# Altium project simulateTest.PrjPCB
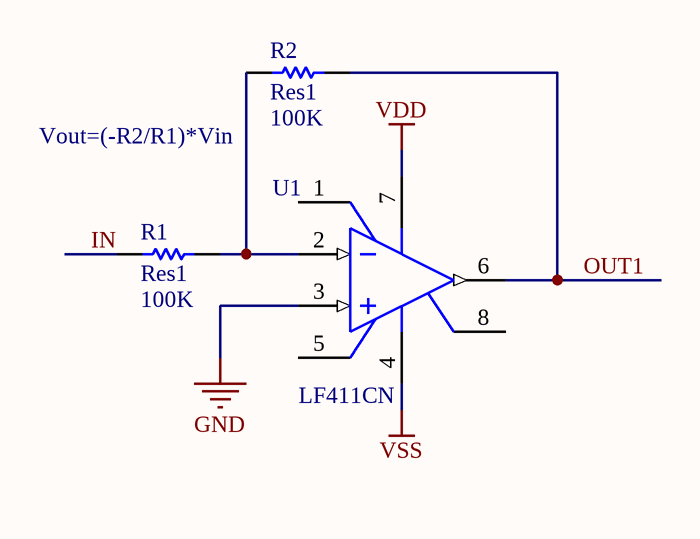
[diagram p0: InverterAmp.SchDoc]
11 sheets, 61 parts. Net scope: global (net labels, ports and power ports of the same name join across sheets).
Sheets:
  InverterAmp.SchDoc
  amplifier.SchDoc
  powerSource.SchDoc
  summator.SchDoc
  InverterSum.SchDoc
  subtracter.SchDoc
  integrator.SchDoc
  differentiator.SchDoc
  differentialAmp.SchDoc
  currentDetection.SchDoc
  sine-waveGenerator.SchDoc

## Sheet InverterAmp.SchDoc
size A4

### Parts
R1  Res1  value 100K  [AXIAL-0.3]
R2  Res1  value 100K  [AXIAL-0.3]
U1  LF411CN  [N08E]

### Nets
GND: U1.3(IN+)
VDD: U1.7(V+)  [project net VDD12]
VSS: U1.4(V-)  [project net VSS12]
IN: R1.2
OUT1: R2.1 U1.6(OUT)
NetR1_1: R1.1 R2.2 U1.2(IN-)

Not connected (* = marked no-connect by the designer): U1 1(BAL) 5(BAL) 8(NC)

### Notes on the sheet
- (near R2) Vout=(-R2/R1)*Vin

### Library data of the parts
R1 R2 = Res1: Resistor; Published: 8-Jun-2000; LatestRevisionDate: 17-Jul-2002; LatestRevisionNote: Re-released for DXP Platform.; PackageReference: AXIAL-0.3; Publisher: Altium Limited; PackageDescription: Axial Device, Thru-Hole; 2 Leads; 0.3 in Pin Spacing
U1 = LF411CN: Low Offset, Low Drift JFET Input Operational Amplifier, 8-pin MDIP; Manufacturer: National Semiconductor; PackageTopMarking: NSUZXYTTE#*LF*411CN; PowerWise: N; CompType: Amplifiers; Published: 4-Dec-2008; LatestRevisionDate: 13-Jan-2009; LatestRevisionNote: Sim Model Added.; DatasheetVersion: Aug-2000; PackageVersion: revG, May-2006; PackageReference: N08E; Publisher: Altium Limited; PackageDescription: MDIP, .365 x .250 x .130in, 8 Lead, .100in Pitch; Supplier 1: Farnell; Supplier Part Number 1: 9487026; PartNumber: LF411CN; RoHS: N; PinCount: 8; Code_JEDEC: MS-001-BA; ComponentLink1Description: LF411 Datasheet; ComponentLink1URL: http://www.national.com/ds/LF/LF411.pdf; ComponentLink2Description: LF411 Web Page; ComponentLink2URL: http://www.national.com/pf/LF/LF411.html; ComponentLink3Description: N08E Package Page; ComponentLink3URL: http://www.national.com/packaging/folders/n08e.html

## Sheet amplifier.SchDoc
size A4
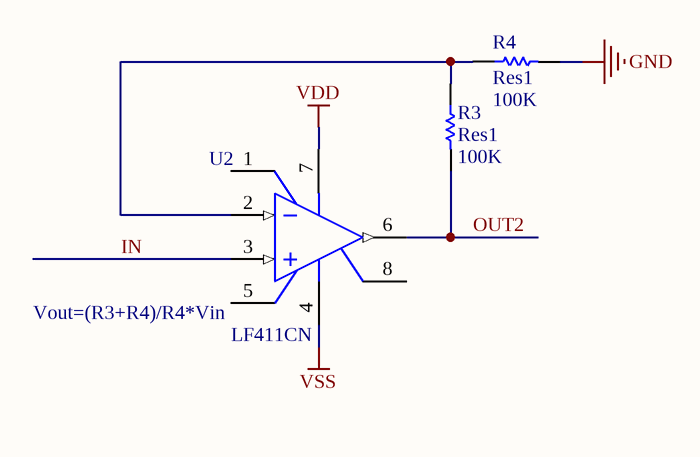
[diagram p1: amplifier.SchDoc]

### Parts
R3  Res1  value 100K  [AXIAL-0.3]
R4  Res1  value 100K  [AXIAL-0.3]
U2  LF411CN  [N08E]

### Nets
GND: R4.2
VDD: U2.7(V+)  [project net VDD12]
VSS: U2.4(V-)  [project net VSS12]
IN: U2.3(IN+)
OUT2: R3.2 U2.6(OUT)
NetR3_1: R3.1 R4.1 U2.2(IN-)

Not connected (* = marked no-connect by the designer): U2 1(BAL) 5(BAL) 8(NC)

### Notes on the sheet
- (near U2) Vout=(R3+R4)/R4*Vin

### Library data of the parts
R3 R4 = Res1: Resistor; Published: 8-Jun-2000; LatestRevisionDate: 17-Jul-2002; LatestRevisionNote: Re-released for DXP Platform.; PackageReference: AXIAL-0.3; Publisher: Altium Limited; PackageDescription: Axial Device, Thru-Hole; 2 Leads; 0.3 in Pin Spacing
U2 = LF411CN: as U1 on sheet InverterAmp; Published: 4-Dec-2008; LatestRevisionDate: 13-Jan-2009; LatestRevisionNote: Sim Model Added.; DatasheetVersion: Aug-2000; PackageVersion: revG, May-2006; PackageReference: N08E; Publisher: Altium Limited; PackageDescription: MDIP, .365 x .250 x .130in, 8 Lead, .100in Pitch; Supplier 1: Farnell; Supplier Part Number 1: 9487026; PartNumber: LF411CN; RoHS: N; PinCount: 8; Code_JEDEC: MS-001-BA; ComponentLink1Description: LF411 Datasheet; ComponentLink1URL: http://www.national.com/ds/LF/LF411.pdf; ComponentLink2Description: LF411 Web Page; ComponentLink2URL: http://www.national.com/pf/LF/LF411.html; ComponentLink3Description: N08E Package Page; ComponentLink3URL: http://www.national.com/packaging/folders/n08e.html

## Sheet powerSource.SchDoc
size A4
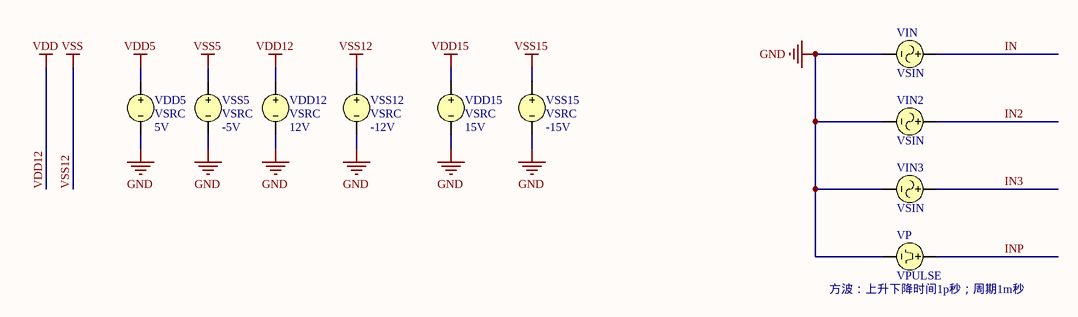
[diagram p2: powerSource.SchDoc]

### Parts
VDD5  VSRC  value 5V
VDD12  VSRC  value 12V
VDD15  VSRC  value 15V
VIN  VSIN
VIN2  VSIN
VIN3  VSIN
VP  VPULSE
VSS5  VSRC  value -5V
VSS12  VSRC  value -12V
VSS15  VSRC  value -15V

### Nets
GND: VDD5.2 VDD12.2 VDD15.2 VIN.2 VIN2.2 VIN3.2 VP.2 VSS5.2 VSS12.2 VSS15.2
VDD5: VDD5.1
VDD12: VDD12.1  [also labelled VDD]
VDD15: VDD15.1
VSS5: VSS5.1
VSS12: VSS12.1  [also labelled VSS]
VSS15: VSS15.1
IN: VIN.1
IN2: VIN2.1
IN3: VIN3.1
INP: VP.1

### Notes on the sheet
- (near VP) 方波：上升下降时间1p秒；周期1m秒

### Library data of the parts
VDD5 VDD12 VDD15 VSS5 VSS12 VSS15 = VSRC: Voltage Source; Note: PCB Footprint - Not required; Published: 8-Jun-2000; LatestRevisionDate: 17-Jul-2002; LatestRevisionNote: Re-released for DXP Platform.; PackageReference: Not Applicable; Publisher: Altium Limited
VIN VIN2 VIN3 = VSIN: Sinusoidal Voltage Source; Note: PCB Footprint - Not required; Published: 8-Jun-2000; LatestRevisionDate: 15-Nov-2004; LatestRevisionNote: Corrected Netlist.; PackageReference: Not Applicable; Publisher: Altium Limited
VP = VPULSE: Pulse Voltage Source; Note: PCB Footprint - Not required; Published: 8-Jun-2000; LatestRevisionDate: 15-Nov-2004; LatestRevisionNote: Corrected Netlist.; PackageReference: Not Applicable; Publisher: Altium Limited

## Sheet summator.SchDoc
size A4
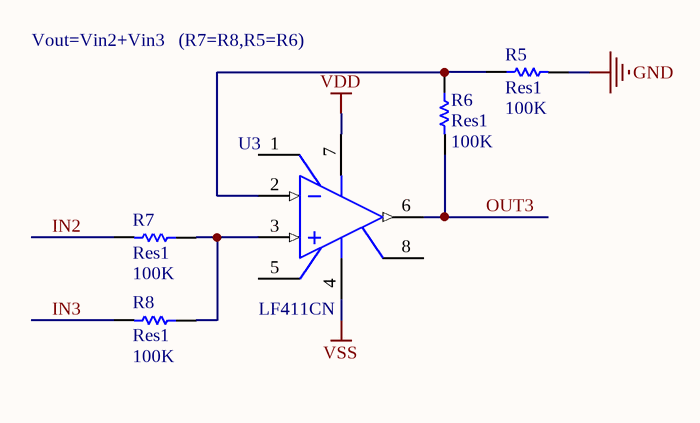
[diagram p3: summator.SchDoc]

### Parts
R5  Res1  value 100K  [AXIAL-0.3]
R6  Res1  value 100K  [AXIAL-0.3]
R7  Res1  value 100K  [AXIAL-0.3]
R8  Res1  value 100K  [AXIAL-0.3]
U3  LF411CN  [N08E]

### Nets
GND: R5.2
VDD: U3.7(V+)  [project net VDD12]
VSS: U3.4(V-)  [project net VSS12]
IN2: R7.2
IN3: R8.2
OUT3: R6.2 U3.6(OUT)
NetR5_1: R5.1 R6.1 U3.2(IN-)
NetR7_1: R7.1 R8.1 U3.3(IN+)

Not connected (* = marked no-connect by the designer): U3 1(BAL) 5(BAL) 8(NC)

### Notes on the sheet
- Vout=Vin2+Vin3   (R7=R8,R5=R6)

### Library data of the parts
R5-R8 = Res1: Resistor; Published: 8-Jun-2000; LatestRevisionDate: 17-Jul-2002; LatestRevisionNote: Re-released for DXP Platform.; PackageReference: AXIAL-0.3; Publisher: Altium Limited; PackageDescription: Axial Device, Thru-Hole; 2 Leads; 0.3 in Pin Spacing
U3 = LF411CN: as U1 on sheet InverterAmp; Published: 4-Dec-2008; LatestRevisionDate: 13-Jan-2009; LatestRevisionNote: Sim Model Added.; DatasheetVersion: Aug-2000; PackageVersion: revG, May-2006; PackageReference: N08E; Publisher: Altium Limited; PackageDescription: MDIP, .365 x .250 x .130in, 8 Lead, .100in Pitch; Supplier 1: Farnell; Supplier Part Number 1: 9487026; PartNumber: LF411CN; RoHS: N; PinCount: 8; Code_JEDEC: MS-001-BA; ComponentLink1Description: LF411 Datasheet; ComponentLink1URL: http://www.national.com/ds/LF/LF411.pdf; ComponentLink2Description: LF411 Web Page; ComponentLink2URL: http://www.national.com/pf/LF/LF411.html; ComponentLink3Description: N08E Package Page; ComponentLink3URL: http://www.national.com/packaging/folders/n08e.html

## Sheet InverterSum.SchDoc
size A4
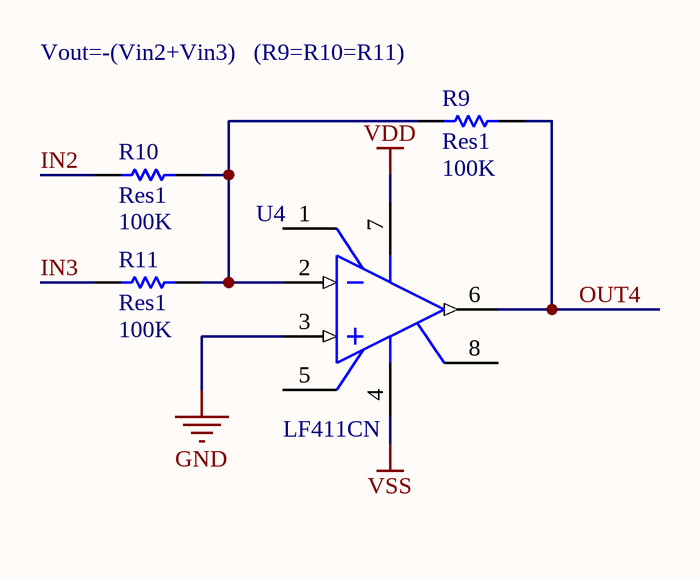
[diagram p4: InverterSum.SchDoc]

### Parts
R9  Res1  value 100K  [AXIAL-0.3]
R10  Res1  value 100K  [AXIAL-0.3]
R11  Res1  value 100K  [AXIAL-0.3]
U4  LF411CN  [N08E]

### Nets
GND: U4.3(IN+)
VDD: U4.7(V+)  [project net VDD12]
VSS: U4.4(V-)  [project net VSS12]
IN2: R10.2
IN3: R11.2
OUT4: R9.1 U4.6(OUT)
NetR9_2: R9.2 R10.1 R11.1 U4.2(IN-)

Not connected (* = marked no-connect by the designer): U4 1(BAL) 5(BAL) 8(NC)

### Notes on the sheet
- (near R9) Vout=-(Vin2+Vin3)   (R9=R10=R11)

### Library data of the parts
R9-R11 = Res1: Resistor; Published: 8-Jun-2000; LatestRevisionDate: 17-Jul-2002; LatestRevisionNote: Re-released for DXP Platform.; PackageReference: AXIAL-0.3; Publisher: Altium Limited; PackageDescription: Axial Device, Thru-Hole; 2 Leads; 0.3 in Pin Spacing
U4 = LF411CN: as U1 on sheet InverterAmp; Published: 4-Dec-2008; LatestRevisionDate: 13-Jan-2009; LatestRevisionNote: Sim Model Added.; DatasheetVersion: Aug-2000; PackageVersion: revG, May-2006; PackageReference: N08E; Publisher: Altium Limited; PackageDescription: MDIP, .365 x .250 x .130in, 8 Lead, .100in Pitch; Supplier 1: Farnell; Supplier Part Number 1: 9487026; PartNumber: LF411CN; RoHS: N; PinCount: 8; Code_JEDEC: MS-001-BA; ComponentLink1Description: LF411 Datasheet; ComponentLink1URL: http://www.national.com/ds/LF/LF411.pdf; ComponentLink2Description: LF411 Web Page; ComponentLink2URL: http://www.national.com/pf/LF/LF411.html; ComponentLink3Description: N08E Package Page; ComponentLink3URL: http://www.national.com/packaging/folders/n08e.html

## Sheet subtracter.SchDoc
size A4
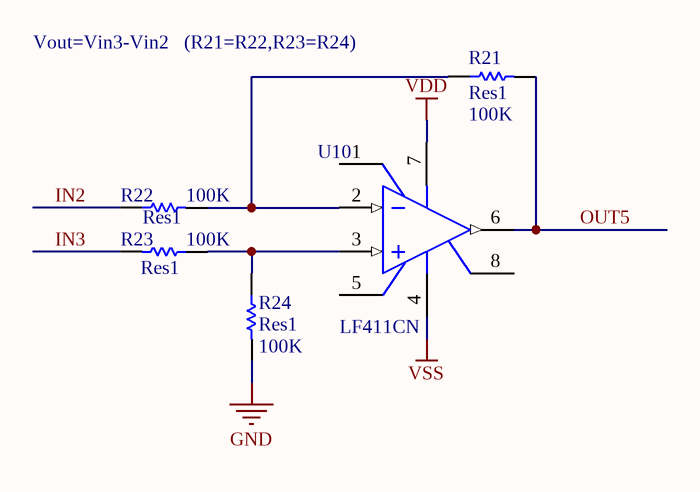
[diagram p5: subtracter.SchDoc]

### Parts
R21  Res1  value 100K  [AXIAL-0.3]
R22  Res1  value 100K  [AXIAL-0.3]
R23  Res1  value 100K  [AXIAL-0.3]
R24  Res1  value 100K  [AXIAL-0.3]
U10  LF411CN  [N08E]

### Nets
GND: R24.2
VDD: U10.7(V+)  [project net VDD12]
VSS: U10.4(V-)  [project net VSS12]
IN2: R22.1
IN3: R23.2
OUT5: R21.2 U10.6(OUT)
NetR21_1: R21.1 R22.2 U10.2(IN-)
NetR23_1: R23.1 R24.1 U10.3(IN+)

Not connected (* = marked no-connect by the designer): U10 1(BAL) 5(BAL) 8(NC)

### Notes on the sheet
- Vout=Vin3-Vin2   (R21=R22,R23=R24)

### Library data of the parts
R21-R24 = Res1: Resistor; Published: 8-Jun-2000; LatestRevisionDate: 17-Jul-2002; LatestRevisionNote: Re-released for DXP Platform.; PackageReference: AXIAL-0.3; Publisher: Altium Limited; PackageDescription: Axial Device, Thru-Hole; 2 Leads; 0.3 in Pin Spacing
U10 = LF411CN: as U1 on sheet InverterAmp; Published: 4-Dec-2008; LatestRevisionDate: 13-Jan-2009; LatestRevisionNote: Sim Model Added.; DatasheetVersion: Aug-2000; PackageVersion: revG, May-2006; PackageReference: N08E; Publisher: Altium Limited; PackageDescription: MDIP, .365 x .250 x .130in, 8 Lead, .100in Pitch; Supplier 1: Farnell; Supplier Part Number 1: 9487026; PartNumber: LF411CN; RoHS: N; PinCount: 8; Code_JEDEC: MS-001-BA; ComponentLink1Description: LF411 Datasheet; ComponentLink1URL: http://www.national.com/ds/LF/LF411.pdf; ComponentLink2Description: LF411 Web Page; ComponentLink2URL: http://www.national.com/pf/LF/LF411.html; ComponentLink3Description: N08E Package Page; ComponentLink3URL: http://www.national.com/packaging/folders/n08e.html

## Sheet integrator.SchDoc
size A4
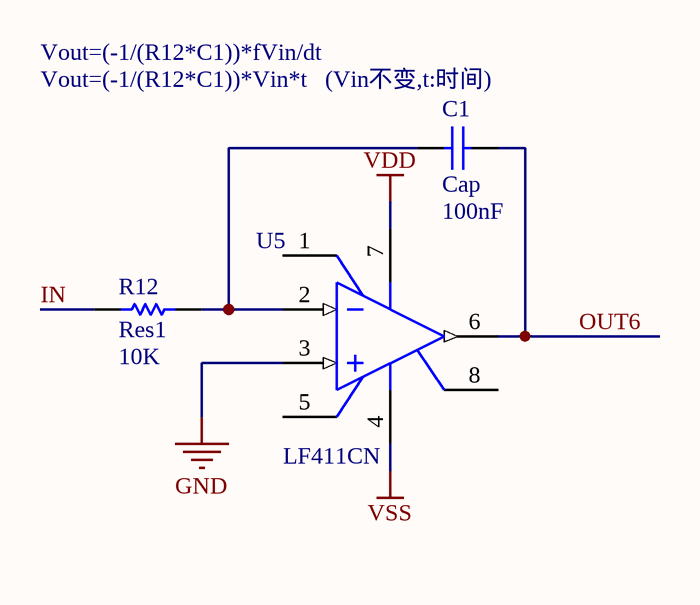
[diagram p6: integrator.SchDoc]

### Parts
C1  Cap  value 100nF  [RAD-0.3]
R12  Res1  value 10K  [AXIAL-0.3]
U5  LF411CN  [N08E]

### Nets
GND: U5.3(IN+)
VDD: U5.7(V+)  [project net VDD12]
VSS: U5.4(V-)  [project net VSS12]
IN: R12.2
OUT6: C1.2 U5.6(OUT)
NetC1_1: C1.1 R12.1 U5.2(IN-)

Not connected (* = marked no-connect by the designer): U5 1(BAL) 5(BAL) 8(NC)

### Notes on the sheet
- Vout=(-1/(R12*C1))*fVin/dt
- (near C1) Vout=(-1/(R12*C1))*Vin*t   (Vin不变,t:时间)

### Library data of the parts
C1 = Cap: Capacitor; Published: 8-Jun-2000; LatestRevisionDate: 17-Jul-2002; LatestRevisionNote: Re-released for DXP Platform.; PackageReference: RAD-0.3; Publisher: Altium Limited; PackageDescription: Radial Cap, Thru-Hole; 2 Leads; 0.3 in Pin Spacing
R12 = Res1: Resistor; Published: 8-Jun-2000; LatestRevisionDate: 17-Jul-2002; LatestRevisionNote: Re-released for DXP Platform.; PackageReference: AXIAL-0.3; Publisher: Altium Limited; PackageDescription: Axial Device, Thru-Hole; 2 Leads; 0.3 in Pin Spacing
U5 = LF411CN: as U1 on sheet InverterAmp; Published: 4-Dec-2008; LatestRevisionDate: 13-Jan-2009; LatestRevisionNote: Sim Model Added.; DatasheetVersion: Aug-2000; PackageVersion: revG, May-2006; PackageReference: N08E; Publisher: Altium Limited; PackageDescription: MDIP, .365 x .250 x .130in, 8 Lead, .100in Pitch; Supplier 1: Farnell; Supplier Part Number 1: 9487026; PartNumber: LF411CN; RoHS: N; PinCount: 8; Code_JEDEC: MS-001-BA; ComponentLink1Description: LF411 Datasheet; ComponentLink1URL: http://www.national.com/ds/LF/LF411.pdf; ComponentLink2Description: LF411 Web Page; ComponentLink2URL: http://www.national.com/pf/LF/LF411.html; ComponentLink3Description: N08E Package Page; ComponentLink3URL: http://www.national.com/packaging/folders/n08e.html

## Sheet differentiator.SchDoc
size A4
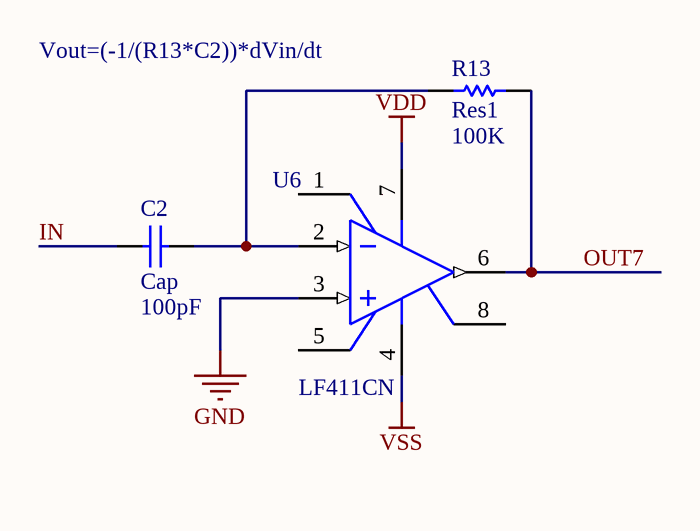
[diagram p7: differentiator.SchDoc]

### Parts
C2  Cap  value 100pF  [RAD-0.3]
R13  Res1  value 100K  [AXIAL-0.3]
U6  LF411CN  [N08E]

### Nets
GND: U6.3(IN+)
VDD: U6.7(V+)  [project net VDD12]
VSS: U6.4(V-)  [project net VSS12]
IN: C2.1
OUT7: R13.1 U6.6(OUT)
NetC2_2: C2.2 R13.2 U6.2(IN-)

Not connected (* = marked no-connect by the designer): U6 1(BAL) 5(BAL) 8(NC)

### Notes on the sheet
- Vout=(-1/(R13*C2))*dVin/dt

### Library data of the parts
C2 = Cap: Capacitor; Published: 8-Jun-2000; LatestRevisionDate: 17-Jul-2002; LatestRevisionNote: Re-released for DXP Platform.; PackageReference: RAD-0.3; Publisher: Altium Limited; PackageDescription: Radial Cap, Thru-Hole; 2 Leads; 0.3 in Pin Spacing
R13 = Res1: Resistor; Published: 8-Jun-2000; LatestRevisionDate: 17-Jul-2002; LatestRevisionNote: Re-released for DXP Platform.; PackageReference: AXIAL-0.3; Publisher: Altium Limited; PackageDescription: Axial Device, Thru-Hole; 2 Leads; 0.3 in Pin Spacing
U6 = LF411CN: as U1 on sheet InverterAmp; Published: 4-Dec-2008; LatestRevisionDate: 13-Jan-2009; LatestRevisionNote: Sim Model Added.; DatasheetVersion: Aug-2000; PackageVersion: revG, May-2006; PackageReference: N08E; Publisher: Altium Limited; PackageDescription: MDIP, .365 x .250 x .130in, 8 Lead, .100in Pitch; Supplier 1: Farnell; Supplier Part Number 1: 9487026; PartNumber: LF411CN; RoHS: N; PinCount: 8; Code_JEDEC: MS-001-BA; ComponentLink1Description: LF411 Datasheet; ComponentLink1URL: http://www.national.com/ds/LF/LF411.pdf; ComponentLink2Description: LF411 Web Page; ComponentLink2URL: http://www.national.com/pf/LF/LF411.html; ComponentLink3Description: N08E Package Page; ComponentLink3URL: http://www.national.com/packaging/folders/n08e.html

## Sheet differentialAmp.SchDoc
size A4
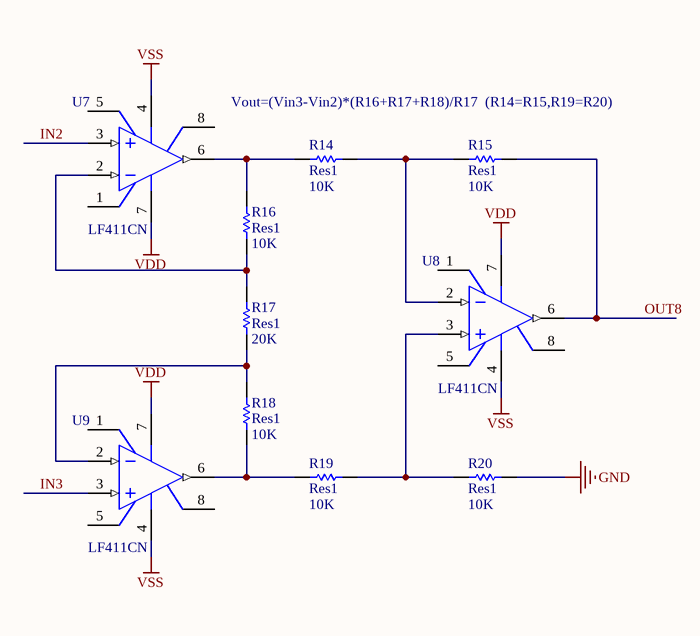
[diagram p8: differentialAmp.SchDoc]

### Parts
R14  Res1  value 10K  [AXIAL-0.3]
R15  Res1  value 10K  [AXIAL-0.3]
R16  Res1  value 10K  [AXIAL-0.3]
R17  Res1  value 20K  [AXIAL-0.3]
R18  Res1  value 10K  [AXIAL-0.3]
R19  Res1  value 10K  [AXIAL-0.3]
R20  Res1  value 10K  [AXIAL-0.3]
U7  LF411CN  [N08E]
U8  LF411CN  [N08E]
U9  LF411CN  [N08E]

### Nets
GND: R20.2
VDD: U7.7(V+) U8.7(V+) U9.7(V+)  [project net VDD12]
VSS: U7.4(V-) U8.4(V-) U9.4(V-)  [project net VSS12]
IN2: U7.3(IN+)
IN3: U9.3(IN+)
OUT8: R15.2 U8.6(OUT)
NetR14_1: R14.1 R16.1 U7.6(OUT)
NetR14_2: R14.2 R15.1 U8.2(IN-)
NetR16_2: R16.2 R17.1 U7.2(IN-)
NetR17_2: R17.2 R18.1 U9.2(IN-)
NetR18_2: R18.2 R19.1 U9.6(OUT)
NetR19_2: R19.2 R20.1 U8.3(IN+)

Not connected (* = marked no-connect by the designer): U7 1(BAL) 5(BAL) 8(NC); U8 1(BAL) 5(BAL) 8(NC); U9 1(BAL) 5(BAL) 8(NC)

### Notes on the sheet
- Vout=(Vin3-Vin2)*(R16+R17+R18)/R17  (R14=R15,R19=R20)

### Library data of the parts
R14-R20 = Res1: Resistor; Published: 8-Jun-2000; LatestRevisionDate: 17-Jul-2002; LatestRevisionNote: Re-released for DXP Platform.; PackageReference: AXIAL-0.3; Publisher: Altium Limited; PackageDescription: Axial Device, Thru-Hole; 2 Leads; 0.3 in Pin Spacing
U7-U9 = LF411CN: as U1 on sheet InverterAmp; Published: 4-Dec-2008; LatestRevisionDate: 13-Jan-2009; LatestRevisionNote: Sim Model Added.; DatasheetVersion: Aug-2000; PackageVersion: revG, May-2006; PackageReference: N08E; Publisher: Altium Limited; PackageDescription: MDIP, .365 x .250 x .130in, 8 Lead, .100in Pitch; Supplier 1: Farnell; Supplier Part Number 1: 9487026; PartNumber: LF411CN; RoHS: N; PinCount: 8; Code_JEDEC: MS-001-BA; ComponentLink1Description: LF411 Datasheet; ComponentLink1URL: http://www.national.com/ds/LF/LF411.pdf; ComponentLink2Description: LF411 Web Page; ComponentLink2URL: http://www.national.com/pf/LF/LF411.html; ComponentLink3Description: N08E Package Page; ComponentLink3URL: http://www.national.com/packaging/folders/n08e.html

## Sheet currentDetection.SchDoc
size A4
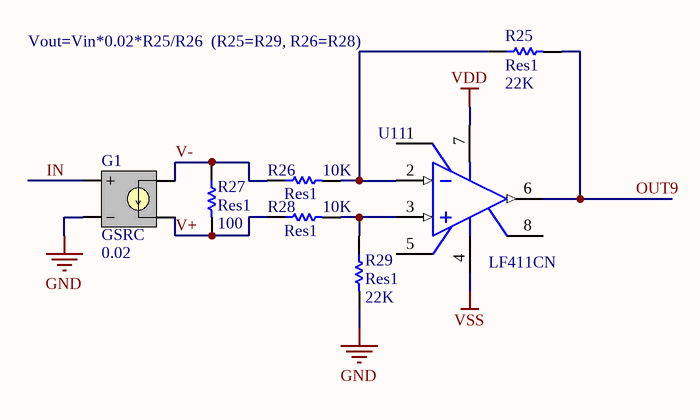
[diagram p9: currentDetection.SchDoc]

### Parts
G1  GSRC  Gain: 0.02
R25  Res1  value 22K  [AXIAL-0.3]
R26  Res1  value 10K  [AXIAL-0.3]
R27  Res1  value 100  [AXIAL-0.3]
R28  Res1  value 10K  [AXIAL-0.3]
R29  Res1  value 22K  [AXIAL-0.3]
U11  LF411CN  [N08E]

### Nets
GND: G1.2(NC-) R29.2
VDD: U11.7(V+)  [project net VDD12]
VSS: U11.4(V-)  [project net VSS12]
IN: G1.1(NC+)
OUT9: R25.2 U11.6(OUT)
V+: G1.4(N-) R27.2 R28.1
V-: G1.3(N+) R26.1 R27.1
NetR25_1: R25.1 R26.2 U11.2(IN-)
NetR28_2: R28.2 R29.1 U11.3(IN+)

Not connected (* = marked no-connect by the designer): U11 1(BAL) 5(BAL) 8(NC)

### Notes on the sheet
- Vout=Vin*0.02*R25/R26  (R25=R29, R26=R28)

### Library data of the parts
G1 = GSRC: Voltage Controlled Current Source; Note: PCB Footprint - Not required; Sim Note: Enter gain into GAIN field; Published: 8-Jun-2000; LatestRevisionDate: 17-Jul-2002; LatestRevisionNote: Re-released for DXP Platform.; PackageReference: Not Applicable; Publisher: Altium Limited
R25-R29 = Res1: Resistor; Published: 8-Jun-2000; LatestRevisionDate: 17-Jul-2002; LatestRevisionNote: Re-released for DXP Platform.; PackageReference: AXIAL-0.3; Publisher: Altium Limited; PackageDescription: Axial Device, Thru-Hole; 2 Leads; 0.3 in Pin Spacing
U11 = LF411CN: as U1 on sheet InverterAmp; Published: 4-Dec-2008; LatestRevisionDate: 13-Jan-2009; LatestRevisionNote: Sim Model Added.; DatasheetVersion: Aug-2000; PackageVersion: revG, May-2006; PackageReference: N08E; Publisher: Altium Limited; PackageDescription: MDIP, .365 x .250 x .130in, 8 Lead, .100in Pitch; Supplier 1: Farnell; Supplier Part Number 1: 9487026; PartNumber: LF411CN; RoHS: N; PinCount: 8; Code_JEDEC: MS-001-BA; ComponentLink1Description: LF411 Datasheet; ComponentLink1URL: http://www.national.com/ds/LF/LF411.pdf; ComponentLink2Description: LF411 Web Page; ComponentLink2URL: http://www.national.com/pf/LF/LF411.html; ComponentLink3Description: N08E Package Page; ComponentLink3URL: http://www.national.com/packaging/folders/n08e.html

## Sheet sine-waveGenerator.SchDoc
size A4
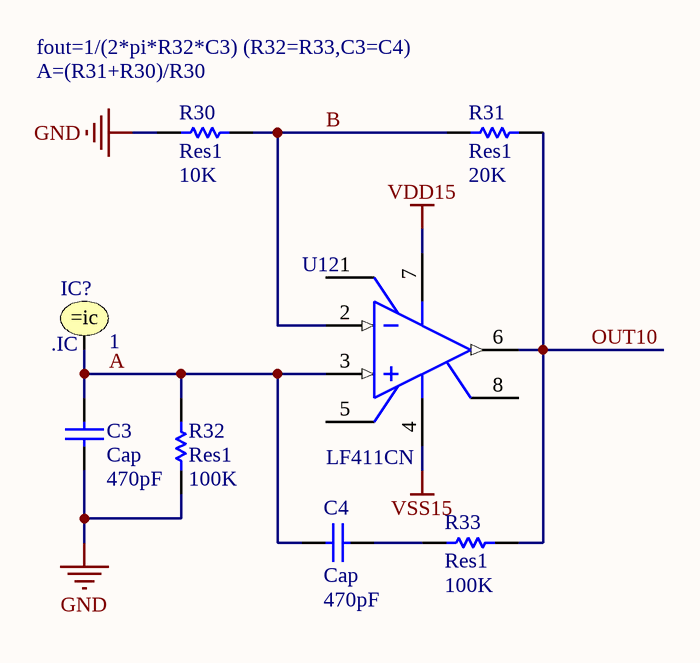
[diagram p10: sine-waveGenerator.SchDoc]

### Parts
C3  Cap  value 470pF  [RAD-0.3]
C4  Cap  value 470pF  [RAD-0.3]
IC?  .IC  Initial Voltage: 1
R30  Res1  value 10K  [AXIAL-0.3]
R31  Res1  value 20K  [AXIAL-0.3]
R32  Res1  value 100K  [AXIAL-0.3]
R33  Res1  value 100K  [AXIAL-0.3]
U12  LF411CN  [N08E]

### Nets
GND: C3.1 R30.2 R32.2
VDD15: U12.7(V+)
VSS15: U12.4(V-)
A: C3.2 C4.1 IC?.1 R32.1 U12.3(IN+)
B: R30.1 R31.2 U12.2(IN-)
OUT10: R31.1 R33.1 U12.6(OUT)
NetC4_2: C4.2 R33.2

Not connected (* = marked no-connect by the designer): U12 1(BAL) 5(BAL) 8(NC)

### Notes on the sheet
- fout=1/(2*pi*R32*C3) (R32=R33,C3=C4)
- (near R30) A=(R31+R30)/R30

### Library data of the parts
C3 C4 = Cap: Capacitor; Published: 8-Jun-2000; LatestRevisionDate: 17-Jul-2002; LatestRevisionNote: Re-released for DXP Platform.; PackageReference: RAD-0.3; Publisher: Altium Limited; PackageDescription: Radial Cap, Thru-Hole; 2 Leads; 0.3 in Pin Spacing
IC? = .IC: Initial Condition; Published: 8-Jun-2000; LatestRevisionDate: 17-Jul-2002; LatestRevisionNote: Re-released for DXP Platform.; PackageReference: Not Applicable; Publisher: Altium Limited
R30-R33 = Res1: Resistor; Published: 8-Jun-2000; LatestRevisionDate: 17-Jul-2002; LatestRevisionNote: Re-released for DXP Platform.; PackageReference: AXIAL-0.3; Publisher: Altium Limited; PackageDescription: Axial Device, Thru-Hole; 2 Leads; 0.3 in Pin Spacing
U12 = LF411CN: as U1 on sheet InverterAmp; Published: 4-Dec-2008; LatestRevisionDate: 13-Jan-2009; LatestRevisionNote: Sim Model Added.; DatasheetVersion: Aug-2000; PackageVersion: revG, May-2006; PackageReference: N08E; Publisher: Altium Limited; PackageDescription: MDIP, .365 x .250 x .130in, 8 Lead, .100in Pitch; Supplier 1: Farnell; Supplier Part Number 1: 9487026; PartNumber: LF411CN; RoHS: N; PinCount: 8; Code_JEDEC: MS-001-BA; ComponentLink1Description: LF411 Datasheet; ComponentLink1URL: http://www.national.com/ds/LF/LF411.pdf; ComponentLink2Description: LF411 Web Page; ComponentLink2URL: http://www.national.com/pf/LF/LF411.html; ComponentLink3Description: N08E Package Page; ComponentLink3URL: http://www.national.com/packaging/folders/n08e.html

## Nets that join several sheets
GND: InverterAmp (U1.3), amplifier (R4.2), powerSource (10 pins), summator (R5.2), InverterSum (U4.3), subtracter (R24.2), integrator (U5.3), differentiator (U6.3), differentialAmp (R20.2), currentDetection (G1.2 R29.2), sine-waveGenerator (C3.1 R30.2 R32.2)
VDD12: InverterAmp (U1.7), amplifier (U2.7), powerSource (VDD12.1), summator (U3.7), InverterSum (U4.7), subtracter (U10.7), integrator (U5.7), differentiator (U6.7), differentialAmp (U7.7 U8.7 U9.7), currentDetection (U11.7)
VDD15: powerSource (VDD15.1), sine-waveGenerator (U12.7)
VSS12: InverterAmp (U1.4), amplifier (U2.4), powerSource (VSS12.1), summator (U3.4), InverterSum (U4.4), subtracter (U10.4), integrator (U5.4), differentiator (U6.4), differentialAmp (U7.4 U8.4 U9.4), currentDetection (U11.4)
VSS15: powerSource (VSS15.1), sine-waveGenerator (U12.4)
IN: InverterAmp (R1.2), amplifier (U2.3), powerSource (VIN.1), integrator (R12.2), differentiator (C2.1), currentDetection (G1.1)
IN2: powerSource (VIN2.1), summator (R7.2), InverterSum (R10.2), subtracter (R22.1), differentialAmp (U7.3)
IN3: powerSource (VIN3.1), summator (R8.2), InverterSum (R11.2), subtracter (R23.2), differentialAmp (U9.3)